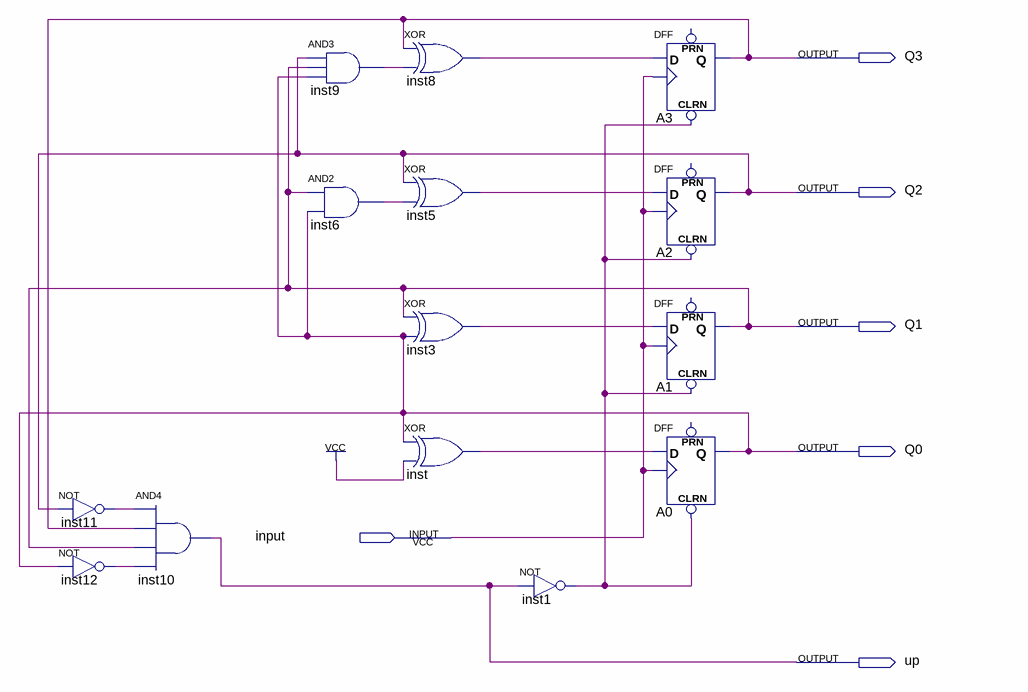
[diagram p0: schematic sheet]
// Quartus schematic bcd.bdf as structural Verilog: 14 symbols, 6 pins
module bcd (
  input  \input ,
  output Q3,
  output Q2,
  output Q1,
  output Q0,
  output up
);

  wire inst1_out, inst3_out, inst5_out, inst6_out, inst8_out, inst9_out, inst11_out, inst12_out, inst_out;

  not inst11 (inst11_out, Q2);
  not inst12 (inst12_out, Q0);
  and inst10 (up, inst11_out, Q3, Q1, inst12_out);
  and inst9 (inst9_out, Q2, Q1, Q0);
  and inst6 (inst6_out, Q1, Q0);
  xor inst8 (inst8_out, Q3, inst9_out);
  xor inst5 (inst5_out, Q2, inst6_out);
  xor inst3 (inst3_out, Q1, Q0);
  xor inst (inst_out, Q0, 1'b1);
  not inst1 (inst1_out, up);
  DFF A3 (.CLRN(inst1_out), .CLK(\input ), .D(inst8_out), .Q(Q3));  // open: PRN
  DFF A2 (.CLRN(inst1_out), .CLK(\input ), .D(inst5_out), .Q(Q2));  // open: PRN
  DFF A1 (.CLRN(inst1_out), .CLK(\input ), .D(inst3_out), .Q(Q1));  // open: PRN
  DFF A0 (.CLRN(inst1_out), .CLK(\input ), .D(inst_out), .Q(Q0));  // open: PRN
endmodule
